# EAGLE schematic NoiseSampleHold (EAGLE 9.6.2)
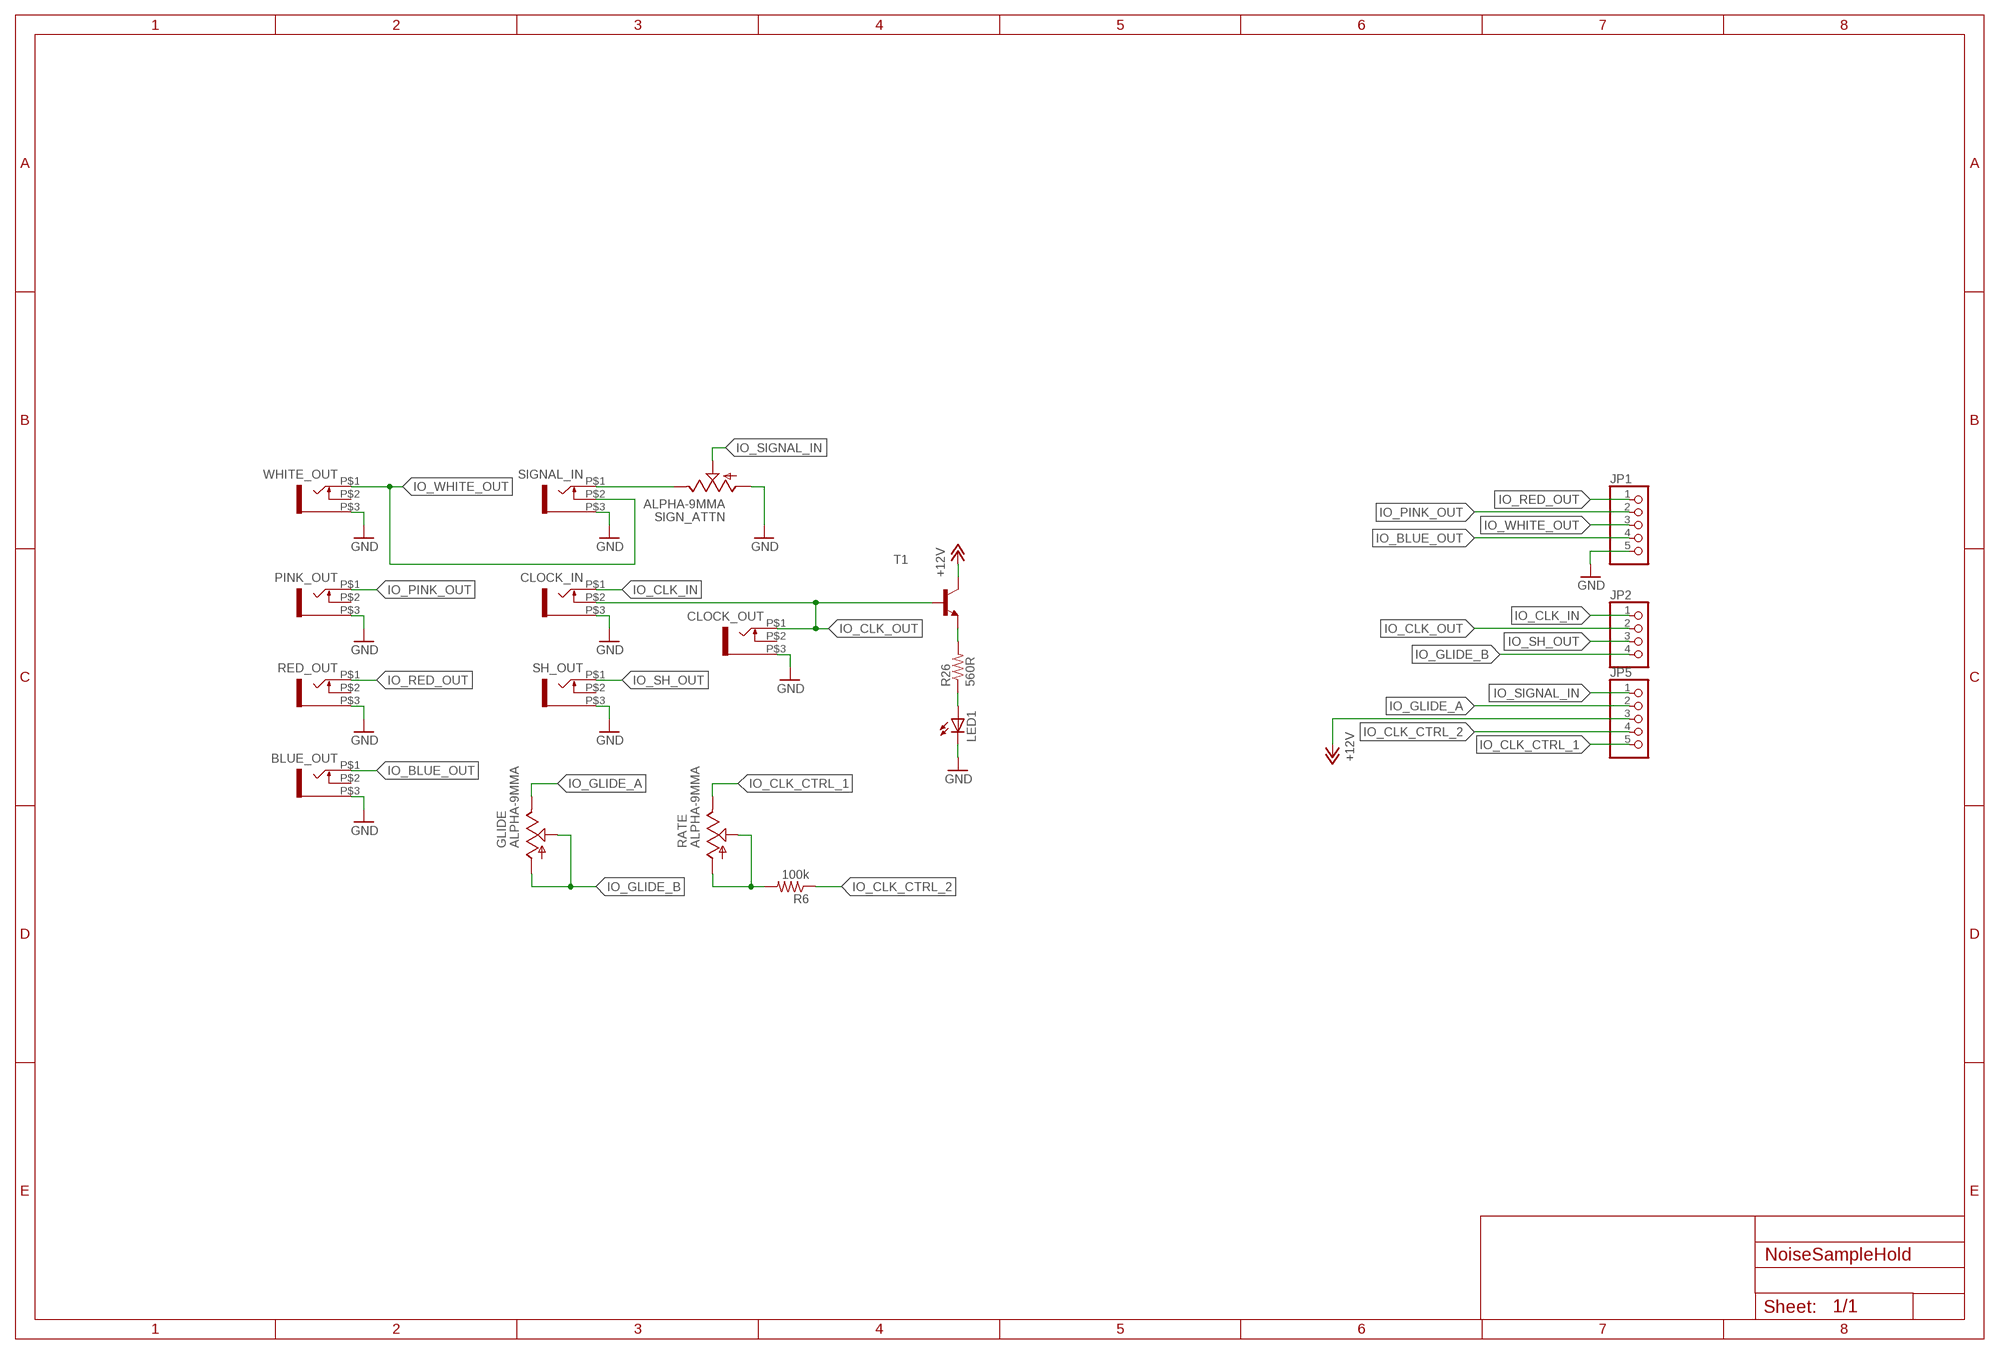
[diagram p0: schematic, sheet 1]

## Parts
BLUE_OUT  WQP-PJ301M-12_JACK  [WQP-PJ301M-12_JACK]
CLOCK_IN  WQP-PJ301M-12_JACK  [WQP-PJ301M-12_JACK]
CLOCK_OUT  WQP-PJ301M-12_JACK  [WQP-PJ301M-12_JACK]
GLIDE  ALPHA-9MMA  [EVUF]
JP1  PINHD-1X5  [1X05]
JP2  PINHD-1X4  [1X04]
JP5  PINHD-1X5  [1X05]
LED1  LED3MM  [LED3MM]
PINK_OUT  WQP-PJ301M-12_JACK  [WQP-PJ301M-12_JACK]
R6  100k  R-US_0204/7  [0204/7]
R26  560R  R-US_0204/7  [0204/7]
RATE  ALPHA-9MMA  [EVUF]
RED_OUT  WQP-PJ301M-12_JACK  [WQP-PJ301M-12_JACK]
SH_OUT  WQP-PJ301M-12_JACK  [WQP-PJ301M-12_JACK]
SIGN_ATTN  ALPHA-9MMA  [EVUF]
SIGNAL_IN  WQP-PJ301M-12_JACK  [WQP-PJ301M-12_JACK]
T1  BC550-NPN-TO92-CBE  [TO92-CBE]
WHITE_OUT  WQP-PJ301M-12_JACK  [WQP-PJ301M-12_JACK]

## Nets
+12V: JP5.3 T1.C
GND: BLUE_OUT.P$3 CLOCK_IN.P$3 CLOCK_OUT.P$3 JP1.5 LED1.K(C) PINK_OUT.P$3 RED_OUT.P$3 SH_OUT.P$3 SIGN_ATTN.1(A) SIGNAL_IN.P$3 WHITE_OUT.P$3
IO_BLUE_OUT: BLUE_OUT.P$1 JP1.4
IO_CLK_CTRL_1: JP5.5 RATE.3(E)
IO_CLK_CTRL_2: JP5.4 R6.1
IO_CLK_IN: CLOCK_IN.P$1 JP2.1
IO_CLK_OUT: CLOCK_IN.P$2 CLOCK_OUT.P$1 JP2.2 T1.B
IO_GLIDE_A: GLIDE.3(E) JP5.2
IO_GLIDE_B: GLIDE.1(A) GLIDE.2(S) JP2.4
IO_PINK_OUT: JP1.2 PINK_OUT.P$1
IO_RED_OUT: JP1.1 RED_OUT.P$1
IO_SH_OUT: JP2.3 SH_OUT.P$1
IO_SIGNAL_IN: JP5.1 SIGN_ATTN.2(S)
IO_WHITE_OUT: JP1.3 SIGNAL_IN.P$2 WHITE_OUT.P$1
N$8: SIGN_ATTN.3(E) SIGNAL_IN.P$1
N$14: LED1.A R26.1
N$15: R26.2 T1.E
N$27: R6.2 RATE.1(A) RATE.2(S)
Unconnected: BLUE_OUT.P$2 CLOCK_OUT.P$2 PINK_OUT.P$2 RED_OUT.P$2 SH_OUT.P$2 WHITE_OUT.P$2

## Library data of the parts
BLUE_OUT CLOCK_IN CLOCK_OUT PINK_OUT RED_OUT SH_OUT SIGNAL_IN WHITE_OUT = thonkiconn:WQP-PJ301M-12_JACK
GLIDE RATE SIGN_ATTN = TomW:ALPHA-9MM: 9 mm Square Rotary Potentiometers Source: Panasonic
JP1 JP5 = pinhead:PINHD-1X5: PIN HEADER
JP2 = pinhead:PINHD-1X4: PIN HEADER
LED1 = led:LED: LED OSRAM: - CHIPLED LG R971, LG N971, LY N971, LG Q971, LY Q971, LO R971, LY R971 LH N974, LH R974 LS Q976, LO Q976, LY Q976 LO Q996 - Hyper CHIPLED LW Q18S LB Q993, LB Q99A, LB R99A - SideLED LS A670, LO A670, LY A670, LG A670, LP A670 LB A673, LV A673, LT A673, LW A673 LH A674 LY A675 LS A676, LA A676, LO A676, LY A676, LW A676 LS A679, LY A679, LG A679 - Hyper Micro SIDELED® LS Y876, LA Y876, LO Y876, LY Y876 LT Y87S - SmartLED LW L88C, LW L88S LB L89C, LB L89S, LG L890 LS L89K, LO L89K, LY L89K LS L896, LA L896, LO L896, LY L896 - TOPLED LS T670, LO T670, LY T670, LG T670, LP T670 LSG T670, LSP T670, LSY T670, LOP T670, LYG T670 LG T671, LOG T671, LSG T671 LB T673, LV T673, LT T673, LW T673 LH T674 LS T676, LA T676, LO T676, LY T676, LB T676, LH T676, LSB T676, LW T676 LB T67C, LV T67C, LT T67C, LS T67K, LO T67K, LY T67K, LW E67C LS E67B, LA E67B, LO E67B, LY E67B, LB E67C, LV E67C, LT E67C LW T67C LS T679, LY T679, LG T679 LS T770, LO T770, LY T770, LG T770, LP T770 LB T773, LV T773, LT T773, LW T773 LH T774 LS E675, LA E675, LY E675, LS T675 LS T776, LA T776, LO T776, LY T776, LB T776 LHGB T686 LT T68C, LB T68C - Hyper Mini TOPLED® LB M676 - Mini TOPLED Santana® LG M470 LS M47K, LO M47K, LY M47K Source: http://www.osram.convergy.de LUXEON: - LUMILED® LXK2-PW12-R00, LXK2-PW12-S00, LXK2-PW14-U00, LXK2-PW14-V00 LXK2-PM12-R00, LXK2-PM12-S00, LXK2-PM14-U00 LXK2-PE12-Q00, LXK2-PE12-R00, LXK2-PE12-S00, LXK2-PE14-T00, LXK2-PE14-U00 LXK2-PB12-K00, LXK2-PB12-L00, LXK2-PB12-M00, LXK2-PB14-N00, LXK2-PB14-P00, LXK2-PB14-Q00 LXK2-PR12-L00, LXK2-PR12-M00, LXK2-PR14-Q00, LXK2-PR14-R00 LXK2-PD12-Q00, LXK2-PD12-R00, LXK2-PD12-S00 LXK2-PH12-R00, LXK2-PH12-S00 LXK2-PL12-P00, LXK2-PL12-Q00, LXK2-PL12-R00 Source: www.luxeon.com KINGBRIGHT: KA-3528ASYC Source: www.kingbright.com
R6 R26 = resistor:R-US_: RESISTOR, American symbol
T1 = transistor:*-NPN-: NPN Transistror BF959 corrected 2008.03.06